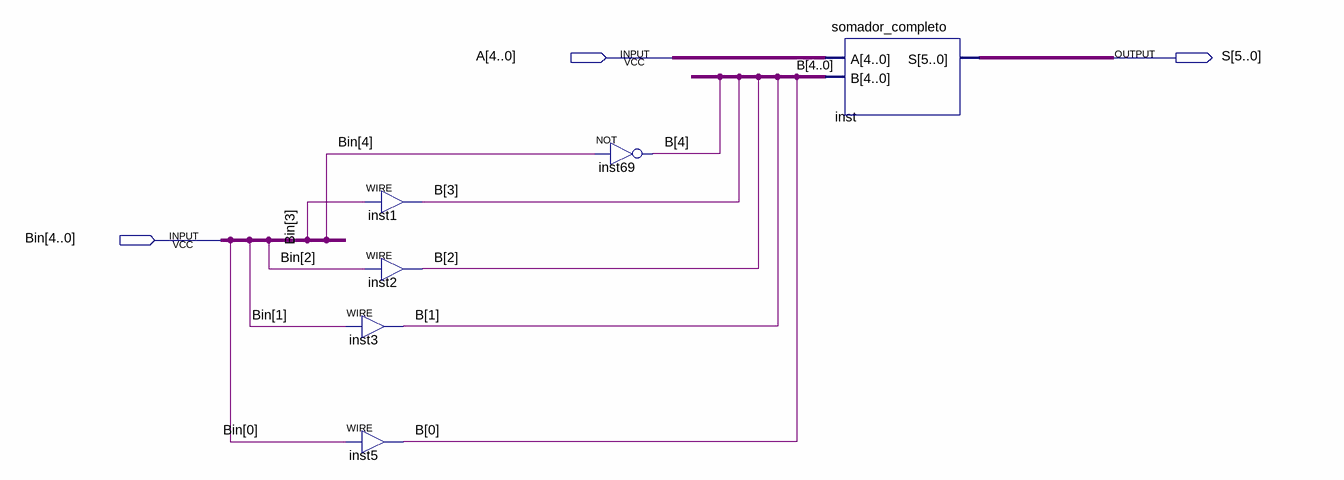
[diagram p0: schematic sheet]
// Quartus schematic subtrator_completo.bdf as structural Verilog: 6 symbols, 3 pins
module subtrator_completo (
  input  [4:0] A,
  input  [4:0] Bin,
  output [5:0] S
);

  wire [4:0] B;

  assign B[1] = Bin[1];  // WIRE inst3
  assign B[0] = Bin[0];  // WIRE inst5
  assign B[3] = Bin[3];  // WIRE inst1
  assign B[2] = Bin[2];  // WIRE inst2
  not inst69 (B[4], Bin[4]);
  somador_completo inst (.A(A), .B(B), .S(S));
endmodule
